# Altium schematic sheet 5V POWER.SchDoc: 5V Power
size B; CheckedBy: Lance Bantoto; Engineer: Cindy Li; Organization: UW Robotics; Address1: 200 University Avenue; Address2: Waterloo; Address3: Ontario; Address4: Canada N2L 3G6; DocumentNumber: 3; Revision: 1; SheetNumber: 3; SheetTotal: 26
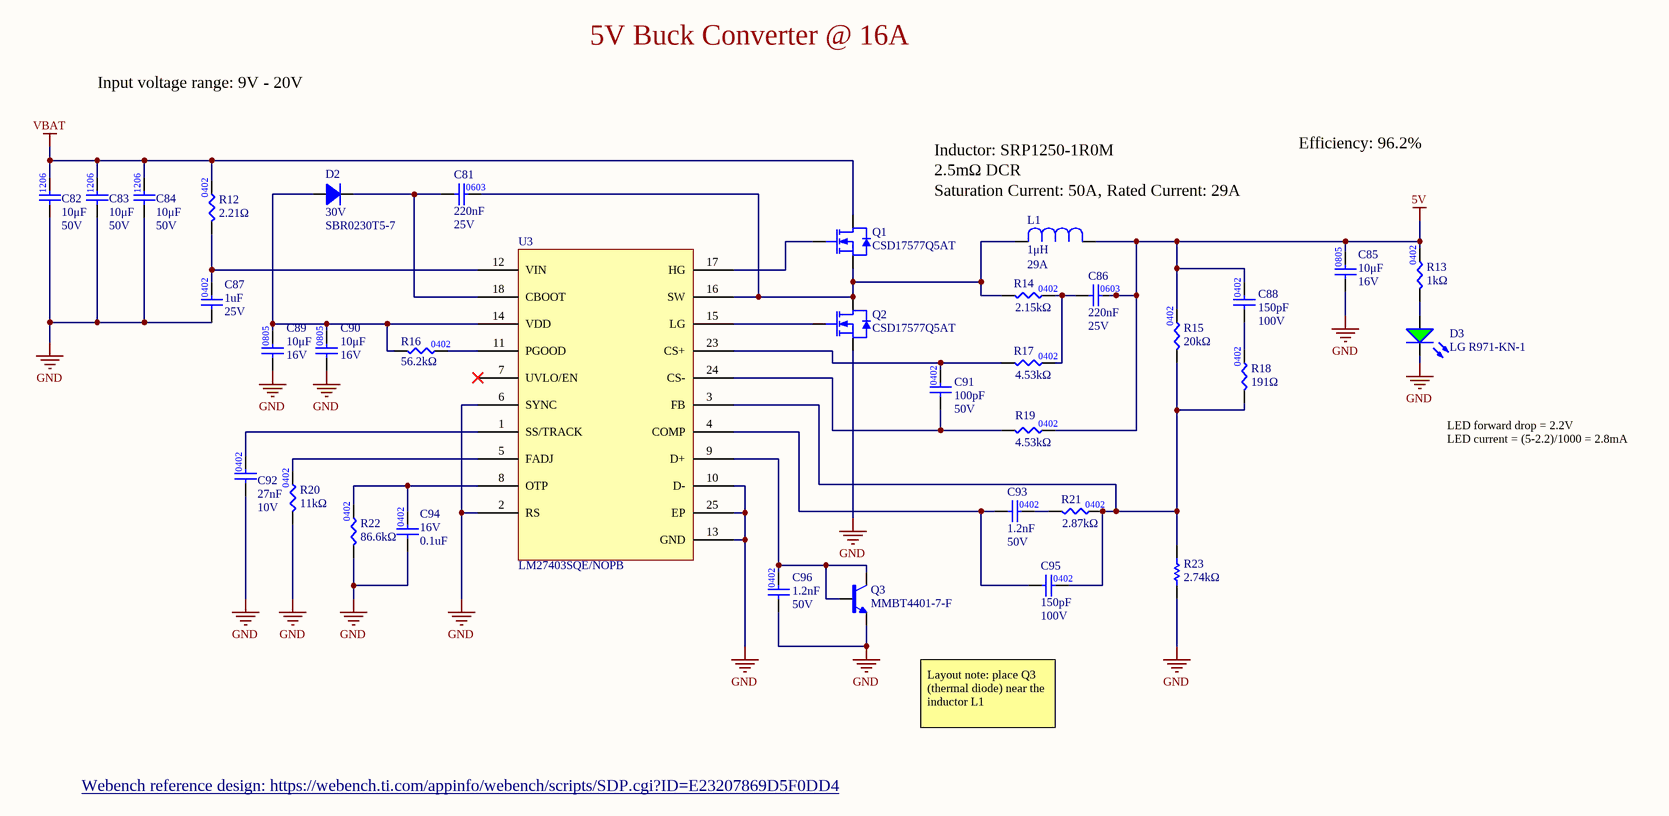
[diagram p0: 5V POWER.SchDoc]

## Parts
C81  Capacitance: 220nF  Rated DC Voltage (URdc): 25V  [CAP0402]  (hidden comment: CAP_0.22uF_25V_X5R_0402)
C82  value 10μF  Voltage Rating: 50V  [CAP1210]  (hidden comment: CAP_10uF_50V_1210)
C83  value 10μF  Voltage Rating: 50V  [CAP1210]  (hidden comment: CAP_10uF_50V_1210)
C84  value 10μF  Voltage Rating: 50V  [CAP1210]  (hidden comment: CAP_10uF_50V_1210)
C85  value 10μF  Voltage Rating: 16V  [CAP2012]  (hidden comment: CAP_10uF_16V_0805)
C86  Capacitance: 220nF  Rated DC Voltage (URdc): 25V  [CAP0402]  (hidden comment: CAP_0.22uF_25V_X5R_0402)
C87  Capacitance: 1uF  Voltage: 25V  [CAP0402]  (hidden comment: CAP_1uF_25V_0402)
C88  Capacitance: 150pF  Rated DC Voltage (URdc): 100V  [CAP0402]  (hidden comment: CAP_150pF_100V_NP0_0402)
C89  value 10μF  Voltage Rating: 16V  [CAP2012]  (hidden comment: CAP_10uF_16V_0805)
C90  value 10μF  Voltage Rating: 16V  [CAP2012]  (hidden comment: CAP_10uF_16V_0805)
C91  Capacitance: 100pF  Voltage: 50V  [CAP0402]  (hidden comment: CAP_100pF_50V_0402)
C92  Capacitance: 27nF  Rated DC Voltage (URdc): 10V  [CAP0402]  (hidden comment: CAP_0.027uF_10V_X7R_0402)
C93  Capacitance: 1.2nF  Rated DC Voltage (URdc): 50V  [CAP0402]  (hidden comment: CAP_1.2nF_50V_X7R_0402)
C94  Rated DC Voltage (URdc): 16V  Capacitance: 0.1uF  [CAP0402]  (hidden comment: CAP_0.1uF_16V_X7R_0402)
C95  Capacitance: 150pF  Rated DC Voltage (URdc): 100V  [CAP0402]  (hidden comment: CAP_150pF_100V_NP0_0402)
C96  Capacitance: 1.2nF  Rated DC Voltage (URdc): 50V  [CAP0402]  (hidden comment: CAP_1.2nF_50V_X7R_0402)
D2  value 30V  [SOD523]  (hidden comment: SBR0230T5-7)
D3  Manufacturer Part Number 1: LG R971-KN-1  [LED_0805_GREEN]  (hidden comment: DIO_LED_G)
L1  Current Rating: 29A  Inductance: 1μH  [IND_BOURNS_SRP1250]  (hidden comment: IND_1uH_29A)
Q1  Manufacturer Part Number 1: CSD17577Q5AT  [MOSFET_CSD19531Q5A]  (hidden comment: NMOS_30V_60A)
Q2  Manufacturer Part Number 1: CSD17577Q5AT  [MOSFET_CSD19531Q5A]  (hidden comment: NMOS_30V_60A)
Q3  MMBT4401-7-F  [MMBT4401-7-F]
R12  value 2.21Ω  [RES0402]  (hidden comment: RES_2.21Ω_0402_1%)
R13  Resistance: 1kΩ  [RES0402]  (hidden comment: RES_1kΩ_0402)
R14  value 2.15kΩ  [RES0402]  (hidden comment: RES_2.15kΩ_0402_1%)
R15  value 20kΩ  [RES0402]  (hidden comment: RES_20kΩ_0402_1%)
R16  value 56.2kΩ  [RES0402]  (hidden comment: RES_56.2kΩ_0402_1%)
R17  value 4.53kΩ  [RES0402]  (hidden comment: RES_4.53kΩ_0402_1%)
R18  value 191Ω  [RES0402]  (hidden comment: RES_191Ω_0402_1%)
R19  value 4.53kΩ  [RES0402]  (hidden comment: RES_4.53kΩ_0402_1%)
R20  value 11kΩ  [RES0402]  (hidden comment: RES_11kΩ_0402_1%)
R21  value 2.87kΩ  [RES0402]  (hidden comment: RES_2.87kΩ_0402_1%)
R22  value 86.6kΩ  [RES0402]  (hidden comment: RES_86.6kΩ_0402_1%)
R23  value 2.74kΩ  [RES0402]  (hidden comment: RES_2.74kΩ_0402_1%)
U3  LM27403SQE/NOPB  [QFN50P400X400X80-25N]

## Nets
5V: C85.2 C86.2 C88.2 L1.1 R13.2 R15.2 R19.2
GND: C82.1 C83.1 C84.1 C85.1 C87.1 C89.1 C90.1 C92.1 C94.1 C96.1 D3.2(K) Q2.1(Source) Q3.2 R20.1 R22.1 R23.1 U3.2(RS) U3.6(SYNC) U3.10(D-) U3.13(GND) U3.25(EP)
VBAT: C82.2 C83.2 C84.2 Q1.3(Drain) R12.2
NetC81_1: C81.1 D2.1 U3.18(CBOOT)
NetC81_2: C81.2 L1.2 Q1.1(Source) Q2.3(Drain) R14.1 U3.16(SW)
NetC86_1: C86.1 R14.2 R17.2
NetC87_2: C87.2 R12.1 U3.12(VIN)
NetC88_1: C88.1 R18.2
NetC89_2: C89.2 C90.2 D2.2 R16.1 U3.14(VDD)
NetC91_1: C91.1 R19.1 U3.24(CS-)
NetC91_2: C91.2 R17.1 U3.23(CS+)
NetC92_2: C92.2 U3.1(SS/TRACK)
NetC93_1: C93.1 C95.1 U3.4(COMP)
NetC93_2: C93.2 R21.1
NetC94_2: C94.2 R22.2 U3.8(OTP)
NetC95_2: C95.2 R15.1 R18.1 R21.2 R23.2 U3.3(FB)
NetC96_2: C96.2 Q3.1 Q3.3 U3.9(D+)
NetD3_1: D3.1(A) R13.1
NetQ1_2: Q1.2(Gate) U3.17(HG)
NetQ2_2: Q2.2(Gate) U3.15(LG)
NetR16_2: R16.2 U3.11(PGOOD)
NetR20_2: R20.2 U3.5(FADJ)

Not connected (* = marked no-connect by the designer): U3 7(UVLO/EN)*

## Notes on the sheet
- 5V Buck Converter @ 16A
- Input voltage range: 9V - 20V
- Efficiency: 96.2%
- Inductor: SRP1250-1R0M
- 2.5mΩ DCR
- (near L1) Saturation Current: 50A, Rated Current: 29A
- LED forward drop = 2.2V
  LED current = (5-2.2)/1000 = 2.8mA
- Layout note: place Q3 (thermal diode) near the inductor L1
- Webench reference design: https://webench.ti.com/appinfo/webench/scripts/SDP.cgi?ID=E23207869D5F0DD4 <https://webench.ti.com/appinfo/webench/scripts/SDP.cgi?ID=E23207869D5F0DD4>
- Title:
- Project:
- Date:
- Rev:
- Reviewer:
- Engineer:
- Sheet:
- of
- (in symbol CAP_0.22uF_25V_X5R_0402) 0603
- (in symbol CAP_10uF_50V_1210) 1206

## Library data of the parts
C81 C86 = CAP_0.22uF_25V_X5R_0402: 0.22 µF ±10% 25V Ceramic Capacitor X5R 0402 (1005 Metric); Manufacturer: Yageo; Manufacturer Part Number: CC0402KRX5R8BB224; Multilayer: Yes; Negative Tolerance: 5; Positive Tolerance: 5%; Supplier 1: Digi-Key; Supplier Part Number 1: 311-3341-1-ND; RoHS: Yes; Category: Ceramic Capacitors; Pricing 1: 1=0.10000, 10=0.04000, 50=0.02200, 100=0.01800, 500=0.01288, 1000=0.01012, 2500=0.00920, 5000=0.00846 (USD); Mount: Surface Mount; Number of Pins: 2; Dielectric Material: Ceramic; Package Shape: Rectangular; Min Operating Temperature: -55°C; Max Operating Temperature: 125°C; JESD-609 Code: e3; Capacitor Type: Ceramic; Package Style: SMTMeter; Temperature Characteristics Code: X5R; Termination: Wraparound; Length: 1mm; Width: 0.5mm; Height: 0.5mm; REACH SVHC: Yes; RoHS Compliant: Yes; Size Code: 0402
C82-C84 = CAP_10uF_50V_1210: CAP CER 10UF 50V X7R 1210; Manufacturer 1: Murata Electronics; Manufacturer Part Number 1: GRM32ER71H106MA12L; Dielectric: X7R; Supplier 1: Digi-Key; Supplier Part Number 1: 490-12775-1-ND
C85 = CAP_10uF_16V_0805: CAP CER 10UF 16V X5R 0805; Manufacturer 1: Yageo; Manufacturer Part Number 1: CC0805KKX5R7BB106; Package/Footprint: 0805; Dielectric: X5R; Supplier 1: Digi-Key; Supplier Part Number 1: 311-1865-1-ND; Mounting Type: SMD
C87 = CAP_1uF_25V_0402: ±10% 25V Ceramic Capacitor X5R 0402 (1005 Metric); Manufacturer 1: TDK Corporation; Manufacturer Part Number 1: C1005X5R1E105K050BE; Supplier 1: Digi-Key; Supplier Part Number 1: 445-175215-1-ND; Package: 0402
C88 C95 = CAP_150pF_100V_NP0_0402: ±5% 100V Ceramic Capacitor C0G, NP0 0402 (1005 Metric); Manufacturer: Yageo; Manufacturer Part Number: CGA2B2C0G2A151J050BE; Multilayer: Yes; Negative Tolerance: 5; Temperature Characteristics Code: X7R; Supplier 1: Digi-Key; Supplier Part Number 1: 445-175654-1-ND; RoHS: Yes; Category: Ceramic Capacitors; Pricing 1: 1=0.10000, 10=0.04000, 50=0.02200, 100=0.01800, 500=0.01288, 1000=0.01012, 2500=0.00920, 5000=0.00846 (USD); Mount: Surface Mount; Number of Pins: 2; Dielectric Material: Ceramic; Package Shape: Rectangular; Min Operating Temperature: -55°C; Max Operating Temperature: 125°C; JESD-609 Code: e3; Capacitor Type: Ceramic; Package Style: SMTMeter; Positive Tolerance: 5%; Termination: Wraparound; Length: 1mm; Width: 0.5mm; Height: 0.5mm; REACH SVHC: Yes; RoHS Compliant: Yes; Size Code: 0402
C89 C90 = CAP_10uF_16V_0805: CAP CER 10UF 16V X5R 0805; Manufacturer Part Number 1: CC0805KKX5R7BB106; Manufacturer 1: Yageo; Package/Footprint: 0805; Supplier 1: Digi-Key; Supplier Part Number 1: 311-1865-1-ND; Dielectric: X5R; Mounting Type: SMD
C91 = CAP_100pF_50V_0402: 100 pF ±10% 50V Ceramic Capacitor X7R 0402 (1005 Metric); Manufacturer 1: AVX Corporation; Manufacturer Part Number 1: 04025C101KAT2A; Supplier 1: Digi-Key; Supplier Part Number 1: 478-1089-1-ND; Package: 0402
C92 = CAP_0.027uF_10V_X7R_0402: 0.027 µF ±10% 10V Ceramic Capacitor X7R 0402 (1005 Metric); Manufacturer: Yageo; Manufacturer Part Number: CC0402KRX7R6BB273; Multilayer: Yes; Supplier 1: Digi-Key; Supplier Part Number 1: 311-3794-1-ND; RoHS: Yes; Category: Ceramic Capacitors; Pricing 1: 1=0.10000, 10=0.04000, 50=0.02200, 100=0.01800, 500=0.01288, 1000=0.01012, 2500=0.00920, 5000=0.00846 (USD); Mount: Surface Mount; Number of Pins: 2; Dielectric Material: Ceramic; Package Shape: Rectangular; Min Operating Temperature: -55°C; Max Operating Temperature: 125°C; JESD-609 Code: e3; Capacitor Type: Ceramic; Negative Tolerance: 10%; Package Style: SMTMeter; Positive Tolerance: 10%; Temperature Characteristics Code: X7R; Termination: Wraparound; Length: 1mm; Width: 0.5mm; Height: 0.5mm; REACH SVHC: Yes; RoHS Compliant: Yes; Size Code: 0402
C93 C96 = CAP_1.2nF_50V_X7R_0402: 1200 pF ±5% 50V Ceramic Capacitor X7R 0402 (1005 Metric); Manufacturer: Yageo; Manufacturer Part Number: CC0402JRX7R9BB122; Multilayer: Yes; Negative Tolerance: 5; Supplier 1: Digi-Key; Supplier Part Number 1: 311-3762-1-ND; RoHS: Yes; Category: Ceramic Capacitors; Pricing 1: 1=0.10000, 10=0.04000, 50=0.02200, 100=0.01800, 500=0.01288, 1000=0.01012, 2500=0.00920, 5000=0.00846 (USD); Mount: Surface Mount; Number of Pins: 2; Dielectric Material: Ceramic; Package Shape: Rectangular; Min Operating Temperature: -55°C; Max Operating Temperature: 125°C; JESD-609 Code: e3; Capacitor Type: Ceramic; Package Style: SMTMeter; Positive Tolerance: 5%; Temperature Characteristics Code: X7R; Termination: Wraparound; Length: 1mm; Width: 0.5mm; Height: 0.5mm; REACH SVHC: Yes; RoHS Compliant: Yes; Size Code: 0402
C94 = CAP_0.1uF_16V_X7R_0402: Ceramic Capacitor, Ceramic; Manufacturer: Taiyo Yuden; Manufacturer Part Number: LMK212AC6106MD-T; Multilayer: Yes; Negative Tolerance: 10%; Temperature Characteristics Code: X7R; Supplier 1: Digi-Key; Supplier Part Number 1: 587-6337-1-ND; RoHS: Yes; Stock 1: 703; Pricing 1: 1=0.29000, 10=0.20100, 50=0.12060, 100=0.10180, 500=0.06966, 1000=0.06163 (USD); ComponentLink1URL: https://datasheet.ciiva.com:443/pdfs/VipMasterIC/IC/TAIY/TAIY-S-A0009099504/TAIY-S-A0009099407-1.pdf?src-supplier=IHS+Markit; ComponentLink1Description: https://datasheet.ciiva.com:443/pdfs/VipMasterIC/IC/TAIY/TAIY-S-A0009099504/TAIY-S-A0009099407-1.pdf?src-supplier=IHS+Markit; ComponentLink2URL: https://ds.yuden.co.jp/TYCOMPAS/ut/detail?pn=LMK212AC6106MD-T &amp;u=M&src-supplier=Digi-Key; ComponentLink2Description: https://ds.yuden.co.jp/TYCOMPAS/ut/detail?pn=LMK212AC6106MD-T &amp;u=M&src-supplier=Digi-Key; Supplier 2: Digi-Key; Supplier Part Number 2: 1292-1630-1-ND; Category: Ceramic Capacitors; Stock 2: 20327886; Pricing 2: 1=0.10000, 10=0.02800, 50=0.01500, 100=0.01220, 500=0.00876, 1000=0.00688, 2500=0.00625, 5000=0.00575 (USD); Mount: Surface Mount; Number of Pins: 2; Dielectric Material: Ceramic; Package Shape: Rectangular; Terminal Finish: Nickel; Min Operating Temperature: -55°C; Max Operating Temperature: 125°C; JESD-609 Code: e3; Capacitor Type: Ceramic; Package Style: SMTMeter; Packaging: Tape and Reel; Positive Tolerance: 10%; Termination: Wraparound; Length: 1mm; Width: 0.5mm; Height: 0.5mm; REACH SVHC: Yes; RoHS Compliant: Yes; ComponentLink3URL: https://datasheet.ciiva.com:443/pdfs/VipMasterIC/IC/WATC/WATC-S-A0009550342/WATC-S-A0009550342-1.pdf?src-supplier=IHS+Markit; ComponentLink3Description: https://datasheet.ciiva.com:443/pdfs/VipMasterIC/IC/WATC/WATC-S-A0009550342/WATC-S-A0009550342-1.pdf?src-supplier=IHS+Markit; ComponentLink4URL: http://www.farnell.com/datasheets/2340522.pdf?src-supplier=Farnell; ComponentLink4Description: http://www.farnell.com/datasheets/2340522.pdf?src-supplier=Farnell; ComponentLink5URL: http://components.arrow.com/part/dataview/0323_00654690?src-supplier=Arrow+Europe; ComponentLink5Description: http://components.arrow.com/part/dataview/0323_00654690?src-supplier=Arrow+Europe; ComponentLink6URL: https://www.verical.com/server-webapp/html/getDatasheet?partID=415228&src-supplier=Verical; ComponentLink6Description: https://www.verical.com/server-webapp/html/getDatasheet?partID=415228&src-supplier=Verical; ComponentLink7URL: http://www.passivecomponent.com/indexsea/0402B104K160CT-IN.pdf?src-supplier=Digi-Key; ComponentLink7Description: http://www.passivecomponent.com/indexsea/0402B104K160CT-IN.pdf?src-supplier=Digi-Key; ComponentLink8URL: http://www.passivecomponent.com/wp-content/uploads/2018/10/MLCC.pdf?src-supplier=Digi-Key; ComponentLink8Description: http://www.passivecomponent.com/wp-content/uploads/2018/10/MLCC.pdf?src-supplier=Digi-Key; ComponentLink9URL: http://www.farnell.com/datasheets/2340522.pdf?src-supplier=Element14; ComponentLink9Description: http://www.farnell.com/datasheets/2340522.pdf?src-supplier=Element14; ComponentLink10URL: http://www.farnell.com/datasheets/2340522.pdf?src-supplier=Newark; ComponentLink10Description: http://www.farnell.com/datasheets/2340522.pdf?src-supplier=Newark; Size Code: 0402; Supplier 3: Digi-Key; Supplier Part Number 3: 445-173645-1-ND; Stock 3: 3627; Pricing 3: 1=0.20000, 10=0.14200, 50=0.08080, 100=0.06700, 500=0.04696, 1000=0.03888, 2500=0.03619, 5000=0.03311 (USD); ComponentLink11URL: https://datasheet.ciiva.com:443/pdfs/VipMasterIC/IC/TDKC/TDKC-S-A0007785269/TDKC-S-A0007785269-1.pdf?src-supplier=IHS+Markit; ComponentLink11Description: https://datasheet.ciiva.com:443/pdfs/VipMasterIC/IC/TDKC/TDKC-S-A0007785269/TDKC-S-A0007785269-1.pdf?src-supplier=IHS+Markit; ComponentLink12URL: https://product.tdk.com/info/en/catalog/spec/mlccspec_commercial_soft_en.pdf?src-supplier=Digi-Key; ComponentLink12Description: https://product.tdk.com/info/en/catalog/spec/mlccspec_commercial_soft_en.pdf?src-supplier=Digi-Key
D2 = DIO_30V_200mA: Diode Super Barrier 30 V 200mA Surface Mount SOD-523; Manufacturer 1: Diodes Incorporated; Supplier 1: Digi-Key; Supplier Part Number 1: SBR0230T5-7TR-ND; Manufacturer Part Number 1: SBR0230T5-7
D3 = DIO_LED_G: LED GREEN DIFFUSED 0805 SMD; Manufacturer 1: OSRAM; Forward Voltage Drop: 2.2V; Package/Footprint: 0805; Supplier Part Number 1: 475-1410-1-ND; Supplier 1: Digi-Key; Mounting Type: SMD
L1 = IND_1uH_29A: FIXED IND 1UH 29A 2.5 MOHM SMD; Manufacturer 1: Bourns Inc.; Manufacturer Part Number 1: SRP1250-1R0M; Inductance Tolerance: 20%; Saturation Current: 50A; Test Frequency: 100kHz; DC Resistance (DCR): 2.5mOhm; Mounting Type: SMD; Supplier 1: Digi-Key; Supplier Part Number 1: SRP1250-1R0MCT-ND
Q1 Q2 = NMOS_30V_60A: MOSFET N-CH 30V 60A 8VSON; Manufacturer 1: Texas Instruments; Package/Footprint: 8-PowerTDFN; Vgs (Max): ±20V; Supplier 1: Digi-Key; Supplier Part Number 1: 296-38337-1-ND; Mounting Type: SMD; Verified: No; Id: 60A; Vdss: 30V
Q3 = MMBT4401-7-F: Bipolar (BJT) Transistor NPN 40 V 600 mA 250MHz 310 mW Surface Mount SOT-23-3; Manufacturer 1: Diodes Incorporated; Current - Collector Cutoff (Max): 100nA; Vce Saturation (Max) @ Ib, Ic: 750mV @ 50mA, 500mA; Current - Collector (Ic) (Max): 600mA; Manufacturer Part Number 1: MMBT4401-7-F; Supplier 1: Digi-Key; Supplier Part Number 1: MMBT4401-FDICT-ND; Frequency - Transition: 250MHz
R12 = RES_2.21Ω_0402_1%: RES 2.21 OHM 1% 1/16W 0402; Manufacturer Part Number 1: RMCF0402FT2R21; Manufacturer 1: Yageo; Power: 0.063W, 1/16W; Package/Footprint: 0402; Supplier 1: Digi-Key; Supplier Part Number 1: RMCF0402FT2R21CT-ND; Mounting Type: SMD; Tolerance: 1%
R13 = RES_1kΩ_0402: Fixed Resistor, Metal Glaze/thick Film, 0.063W, 1000ohm, 50V, 1% +/-Tol, 100ppm/Cel, Surface Mount, 0402; Manufacturer: Stackpole Electronics; Manufacturer Part Number: RMCF0402FT1K00; Rated Power Dissipation (P): 63mW; Rated Temperature: 70°C; Temperature Coefficient: 100ppm/°C; Package Height: 0.3mm; Package Length: 1mm; Package Width: 0.5mm; Reference Standard: AEC-Q200; Supplier 1: Digi-Key; Supplier Part Number 1: RMCF0402FT1K00CT-ND; RoHS: Yes; Category: Chip SMD Resistors; Stock 1: 277; Pricing 1: 1=0.10000, 10=0.01500, 100=0.00610, 1000=0.00274, 2500=0.00238, 5000=0.00197 (USD); Mount: Surface Mount; Number of Pins: 2; Package Shape: Rectangular; Terminal Finish: Nickel; Min Operating Temperature: -55°C; Max Operating Temperature: 155°C; Tolerance: 1%; JESD-609 Code: e3; Resistor Type: FIXED RESISTOR; Construction: Rectangular; Package Style: SMTMeter; Packaging: Tape and Reel; Technology: METAL GLAZE/THICK FILM; Termination: Wraparound; Working Voltage: 50V; REACH SVHC: Yes; RoHS Compliant: Yes; ComponentLink1URL: https://datasheet.ciiva.com:443/pdfs/VipMasterIC/IC/SEIE/SEIE-S-A0009541969/SEIE-S-A0009541969-1.pdf?src-supplier=IHS+Markit; ComponentLink1Description: https://datasheet.ciiva.com:443/pdfs/VipMasterIC/IC/SEIE/SEIE-S-A0009541969/SEIE-S-A0009541969-1.pdf?src-supplier=IHS+Markit; ComponentLink2URL: https://datasheet.ciiva.com/15193/getdatasheetpartid-365385-15193418.pdf?src-supplier=Verical; ComponentLink2Description: https://datasheet.ciiva.com/15193/getdatasheetpartid-365385-15193418.pdf?src-supplier=Verical; ComponentLink3URL: https://datasheet.ciiva.com/24336/sei-rmcp-24336266.pdf?src-supplier=Onlinecomponents.com; ComponentLink3Description: https://datasheet.ciiva.com/24336/sei-rmcp-24336266.pdf?src-supplier=Onlinecomponents.com; Size Code: 0402
R14 = RES_2.15kΩ_0402_1%: RES SMD 2.15K OHM 1% 1/16W 0402; Manufacturer Part Number 1: RC0402FR-072K15L; Manufacturer 1: Yageo; Power: 0.063W, 1/16W; Package/Footprint: 0402; Supplier 1: Digi-Key; Supplier Part Number 1: YAG3097CT-ND; Mounting Type: SMD; Tolerance: 1%
R15 = RES_20kΩ_0402_1%: RES SMD 20K OHM 1% 1/16W 0402; Manufacturer Part Number 1: RC0402FR-0720KL; Manufacturer 1: Yageo; Power: 0.063W, 1/16W; Package/Footprint: 0402; Supplier 1: Digi-Key; Supplier Part Number 1: 311-20.0KLRCT-ND; Mounting Type: SMD; Tolerance: 1%
R16 = RES_56.2kΩ_0402_1%: RES SMD 56.2K OHM 1% 1/16W 0402; Manufacturer Part Number 1: RC0402FR-0756K2L; Manufacturer 1: Yageo; Power: 0.063W, 1/16W; Package/Footprint: 0402; Supplier 1: Digi-Key; Supplier Part Number 1: YAG3187CT-ND; Mounting Type: SMD; Tolerance: 1%
R17 R19 = RES_4.53kΩ_0402_1%: RES SMD 4.53K OHM 1% 1/16W 0402; Manufacturer 1: Yageo; Manufacturer Part Number 1: RC0402FR-074K53L; Package/Footprint: 0402; Supplier 1: Digi-Key; Supplier Part Number 1: 311-4.53KLRCT-ND; Tolerance: 1%
R18 = RES_191Ω_0402_1%: RES SMD 191 OHM 1% 1/16W 0402; Manufacturer Part Number 1: RC0402FR-07191RL; Manufacturer 1: Yageo; Power: 0.063W, 1/16W; Package/Footprint: 0402; Supplier 1: Digi-Key; Supplier Part Number 1: YAG3023CT-ND; Mounting Type: SMD; Tolerance: 1%
R20 = RES_11kΩ_0402_1%: RES 11K OHM 1% 1/16W 0402; Manufacturer Part Number 1: RMCF0402FT11K0; Manufacturer 1: Stackpole Electronics Inc; Power: 0.063W, 1/16W; Package/Footprint: 0402; Supplier 1: Digi-Key; Supplier Part Number 1: RMCF0402FT11K0CT-ND; Mounting Type: SMD; Tolerance: 1%
R21 = RES_2.87kΩ_0402_1%: RES SMD 2.87K OHM 1% 1/16W 0402; Manufacturer 1: Yageo; Manufacturer Part Number 1: RC0402FR-072K87L; Package/Footprint: 0402; Supplier 1: Digi-Key; Supplier Part Number 1: YAG3105CT-ND; Tolerance: 1%
R22 = RES_86.6kΩ_0402_1%: RES SMD 86.6K OHM 1% 1/16W 0402; Manufacturer Part Number 1: RC0402FR-0786K6L; Manufacturer 1: Yageo; Power: 0.063W, 1/16W; Package/Footprint: 0402; Supplier 1: Digi-Key; Supplier Part Number 1: YAG3249CT-ND; Mounting Type: SMD; Tolerance: 1%
R23 = RES_2.74kΩ_0402_1%: RES 2.74K OHM 1% 1/16W 0402; Manufacturer Part Number 1: RMCF0402FT2K74; Manufacturer 1: Stackpole Electronics Inc; Power: 0.063W, 1/16W; Package/Footprint: 0402; Supplier 1: Digi-Key; Supplier Part Number 1: RMCF0402FT2K74CT-ND; Mounting Type: SMD; Tolerance: 1%
U3 = LM27403SQE/NOPB: Buck Regulator Positive Output Step-Down - DC-DC Controller IC 24-WQFN (4x4); Manufacturer 1: Texas Instruments; Supply Voltage: 3V - 20V; Switching Frequency: 200kHz - 1.2MHz; Max Duty Cycle: 93%; Manufacturer Part Number 1: LM27403SQE/NOPB; Supplier Part Number 1: 296-37066-1-ND; Supplier 1: Digi-Key; Package: 24-WQFN Exposed Pad